# EAGLE design daughterboard (EAGLE 9.6.1)
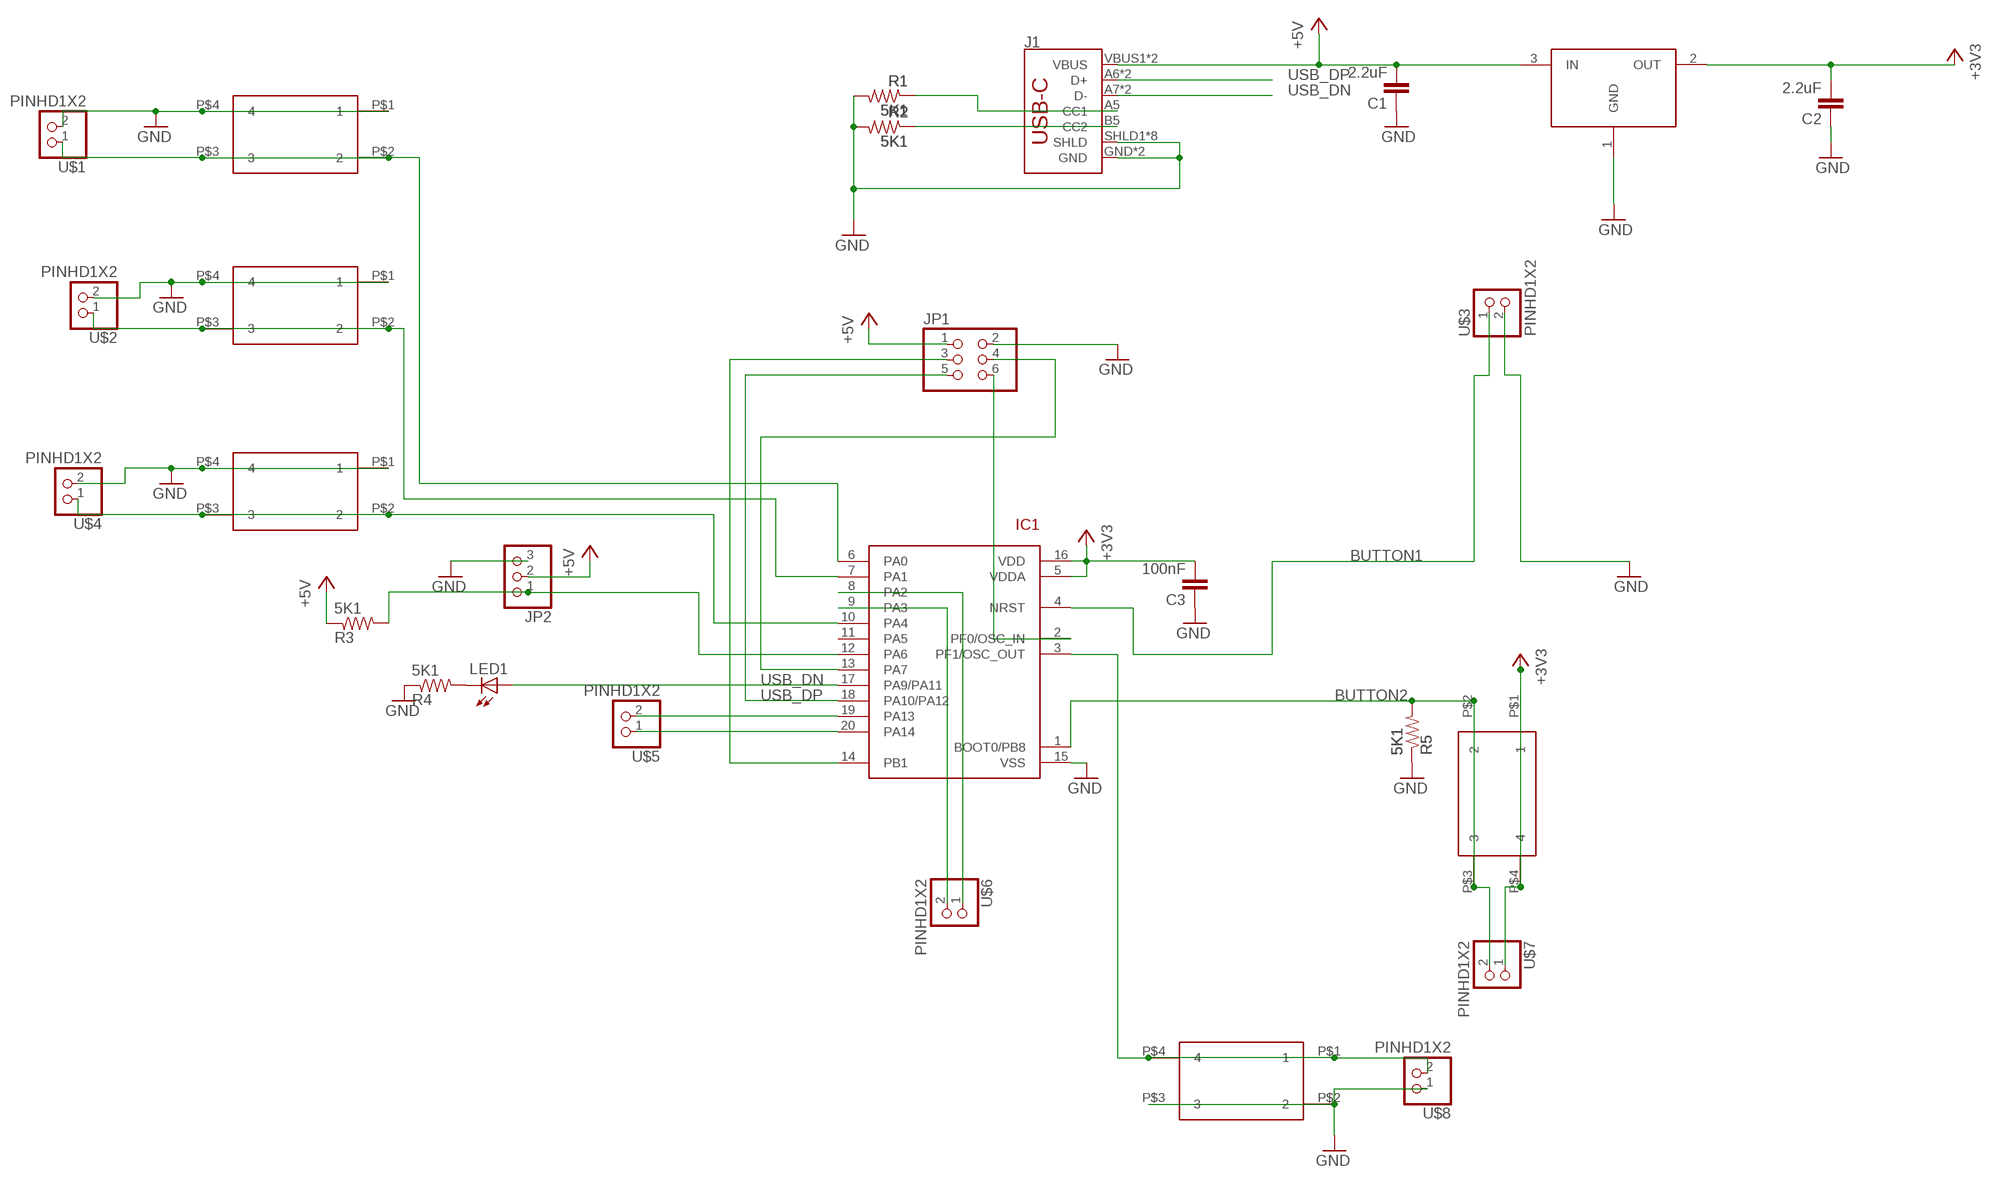
[diagram p0: schematic, sheet 1]

## Parts
C1  2.2uF  CAP0805  [0805@1]
C2  2.2uF  CAP0805  [0805@1]
C3  100nF  CAP0805  [0805@1]
IC1  STM32F042F4  [TSSOP20]
J1  USB_C16PIN  [USB-C-16P]
JP1  PINHD-2X3  [2X03]
JP2  PINHD-1X3CB  [1X03-CLEANBIG]
LED1  LEDCHIP-LED0805  [CHIP-LED0805]
R1  5K1  RESISTOR0805-RES  [0805]
R2  5K1  RESISTOR0805-RES  [0805]
R3  5K1  RESISTOR0805-RES  [0805]
R4  5K1  RESISTOR0805-RES  [0805]
R5  5K1  RESISTOR0805-RES  [0805]
SW1  324_SW  [342_SWICH_FOOT]
SW2  324_SW  [342_SWICH_FOOT]
SW3  324_SW  [342_SWICH_FOOT]
SW4  324_SW  [342_SWICH_FOOT]
SW5  324_SW  [342_SWICH_FOOT]
U1  XC6206_DEV  [SOT23R_INFINEON]
U$1  PINHD1X2  [1X02]
U$2  PINHD1X2  [1X02]
U$3  PINHD1X2  [1X02]
U$4  PINHD1X2  [1X02]
U$5  PINHD1X2  [1X02]
U$6  PINHD1X2  [1X02]
U$7  PINHD1X2  [1X02]
U$8  PINHD1X2  [1X02]

## Nets
+3V3: C2.2 C3.2 IC1.5(VDDA) IC1.16(VDD) SW4.P$1 SW4.P$4 U1.2(OUT) U$7.1
+5V: C1.2 J1.VBUS1(VBUS) J1.VBUS2(VBUS) JP1.1 JP2.2 R3.1 U1.3(IN)
BUTTON1: IC1.4(NRST) U$3.1
BUTTON2: IC1.1(BOOT0/PB8) R5.2 SW4.P$2 SW4.P$3 U$7.2
GND: C1.1 C2.1 C3.1 IC1.15(VSS) J1.GND J1.GND2(GND) J1.SHLD1(SHLD) J1.SHLD2(SHLD) J1.SHLD3(SHLD) J1.SHLD4(SHLD) J1.SHLD5(SHLD) J1.SHLD6(SHLD) J1.SHLD7(SHLD) J1.SHLD8(SHLD) JP1.2 JP2.3 R1.2 R2.2 R4.1 R5.1 SW1.P$1 SW1.P$4 SW2.P$1 SW2.P$4 SW3.P$1 SW3.P$4 SW5.P$2 SW5.P$3 U1.1(GND) U$1.2 U$2.2 U$3.2 U$4.2 U$8.1
N$1: IC1.13(PA7) JP1.4
N$2: IC1.14(PB1) JP1.3
N$3: IC1.19(PA13) U$5.2
N$4: IC1.20(PA14) U$5.1
N$5: IC1.12(PA6) JP2.1 R3.2
N$6: IC1.2(PF0/OSC_IN) JP1.6
N$7: IC1.8(PA2) U$6.1
N$8: IC1.9(PA3) U$6.2
N$9: IC1.10(PA4) SW3.P$2 SW3.P$3 U$4.1
N$10: IC1.7(PA1) SW2.P$2 SW2.P$3 U$2.1
N$11: IC1.6(PA0) SW1.P$2 SW1.P$3 U$1.1
N$12: IC1.3(PF1/OSC_OUT) SW5.P$1 SW5.P$4 U$8.2
N$29: LED1.C R4.2
N$31: J1.B5(CC2) R2.1
N$33: J1.A5(CC1) R1.1
USB_DN: IC1.17(PA9/PA11) J1.A7(D-) J1.B7(D-) LED1.A
USB_DP: IC1.18(PA10/PA12) J1.A6(D+) J1.B6(D+) JP1.5
Unconnected: IC1.11(PA5)

## Library data of the parts
C1-C3 = clock:CAP: Capacitor Standard 0603 ceramic capacitor, and 0.1" leaded capacitor.
IC1 = tx:STM32F042F4
J1 = SparkFun-Connectors:USB_C: USB Type C 16Pin Connector Super Speed pins not available on the 16-pin purely SMD connector so this part is best for USB 2.0 implementations. D1 and D2 are tied together enabling D+/- no matter which way the cable is plugged into the connector. The two channel configuration pins (CC1/2) are exposed. These are normally connected to ground via 5.1k resistors but can be reconfigured for high current/high power applications.; PROD_ID: CONN-14122
JP1 = pinhead:PINHD-2X3: PIN HEADER
JP2 = adafruit_changed:PINHD-1X3: PIN HEADER
LED1 = adafruit:LED: LED OSRAM: - CHIPLED LG R971, LG N971, LY N971, LG Q971, LY Q971, LO R971, LY R971 LH N974, LH R974 LS Q976, LO Q976, LY Q976 LO Q996 - Hyper CHIPLED LW Q18S LB Q993, LB Q99A, LB R99A - SideLED LS A670, LO A670, LY A670, LG A670, LP A670 LB A673, LV A673, LT A673, LW A673 LH A674 LY A675 LS A676, LA A676, LO A676, LY A676, LW A676 LS A679, LY A679, LG A679 - Hyper Micro SIDELED® LS Y876, LA Y876, LO Y876, LY Y876 LT Y87S - SmartLED LW L88C, LW L88S LB L89C, LB L89S, LG L890 LS L89K, LO L89K, LY L89K LS L896, LA L896, LO L896, LY L896 - TOPLED LS T670, LO T670, LY T670, LG T670, LP T670 LSG T670, LSP T670, LSY T670, LOP T670, LYG T670 LG T671, LOG T671, LSG T671 LB T673, LV T673, LT T673, LW T673 LH T674 LS T676, LA T676, LO T676, LY T676, LB T676, LH T676, LSB T676, LW T676 LB T67C, LV T67C, LT T67C, LS T67K, LO T67K, LY T67K, LW E67C LS E67B, LA E67B, LO E67B, LY E67B, LB E67C, LV E67C, LT E67C LW T67C LS T679, LY T679, LG T679 LS T770, LO T770, LY T770, LG T770, LP T770 LB T773, LV T773, LT T773, LW T773 LH T774 LS E675, LA E675, LY E675, LS T675 LS T776, LA T776, LO T776, LY T776, LB T776 LHGB T686 LT T68C, LB T68C - Hyper Mini TOPLED® LB M676 - Mini TOPLED Santana® LG M470 LS M47K, LO M47K, LY M47K Source: http://www.osram.convergy.de/
R1 R2 R5 = joyAnalog:RESISTOR: Resistor Basic schematic elements and footprints for 0603, 1206, and PTH resistors.
R3 R4 = SparkFun-Passives:RESISTOR: Resistor Basic schematic elements and footprints for 0603, 1206, and PTH resistors.
SW1-SW5 = 3pos_slide_switch_centered:324_SW
U1 = 3pos_slide_switch:XC6206_DEV
U$1-U$8 = adafruit_changed:PINHD1X2

## Board
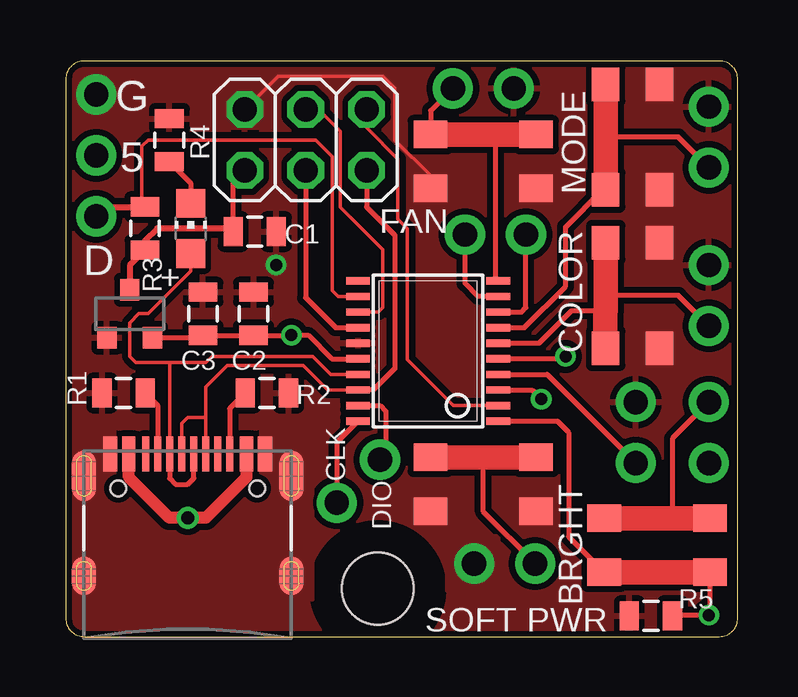
[diagram p1: board, top side]
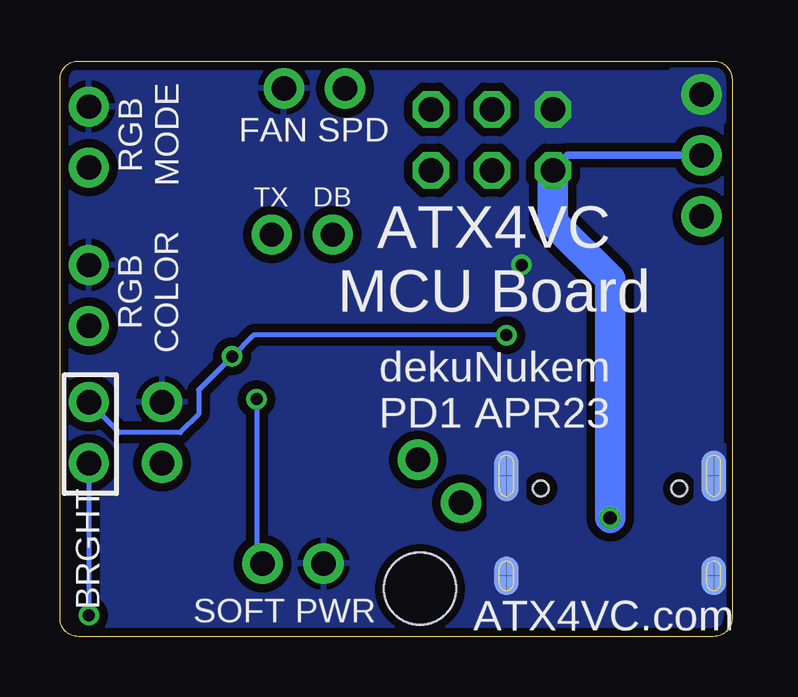
[diagram p2: board, bottom side, seen from below]

Size 28 x 24 mm. Coordinates in mm from the lower left corner, seen from the top.
Outline: 28,0.76 28,23.24 arc90 27.24,24 0.76,24 arc90 0,23.24 0,0.76 arc90 0.76,0 27.24,0 arc90 28,0.76
Copper layers (1*16): Top 0.035mm / dielectric 1.5mm / Bottom 0.035mm
Design rules "deku_2layer_6mil": minimum track width 6mil, minimum drill 15mil, track to track 6mil, track to pad 6mil, pad to pad 6mil, via to via 6mil, smd to smd 6mil, copper to edge 10mil, drill to drill 6mil, minimum pad ring 7mil, minimum via ring 7mil, stop-mask expansion 4mil, vias tented up to drill 25mil, thermal gap 10mil
Holes 3 mm at 13,2
tRestrict: area 10.4,-0.6 to 15.6,4.6

### Footprints (pad centres in the part's own frame; a part is rotated, then mirrored left to right if it is on the bottom)
0805@1 = smd 0.8 x 1.2: 1 -0.9,0; 2 0.9,0
TSSOP20 = smd 0.305 x 0.991: 1 -2.925,-2.918; 2 -2.275,-2.918; 3 -1.625,-2.918; 4 -0.975,-2.918; 5 -0.325,-2.918; 6 0.325,-2.918; 7 0.975,-2.918; 8 1.625,-2.918; 9 2.275,-2.918; 10 2.925,-2.918; 11 2.925,2.918; 12 2.275,2.918; 13 1.625,2.918; 14 0.975,2.918; 15 0.325,2.918; 16 -0.325,2.918; 17 -0.975,2.918; 18 -1.625,2.918; 19 -2.275,2.918; 20 -2.925,2.918
USB-C-16P = smd 0.3 x 1.45: A5 -1.25,0; A6 -0.25,0; A7 0.25,0; A8 1.25,0; B5 1.75,0; B6 0.75,0; B7 -0.75,0; B8 -1.75,0 | smd 0.6 x 1.45: GND -3.225,0; GND2 3.225,0 | smd 1 x 2.1: SHLD1 -4.32,-0.915; SHLD2 4.32,-0.915 | smd 1 x 2.1 bottom: SHLD3 -4.32,-0.915; SHLD4 4.32,-0.915 | smd 1 x 1.6: SHLD5 -4.32,-5.095; SHLD8 4.32,-5.095 | smd 1 x 1.6 bottom: SHLD6 -4.32,-5.095; SHLD7 4.32,-5.095 | smd 0.55 x 1.45: VBUS1 -2.45,0; VBUS2 2.45,0 | hole 0.65: -2.89,-1.445; 2.89,-1.445
2X03 = drill 1.016 octagon: 1 -2.54,-1.27; 2 -2.54,1.27; 3 0,-1.27; 4 0,1.27; 5 2.54,-1.27; 6 2.54,1.27
1X03-CLEANBIG = drill 1.016 pad 1.676: 1 -2.54,0; 2 0,0; 3 2.54,0
CHIP-LED0805 = smd 1.2 x 1.2: A 0,-1.05; C 0,1.05
0805 = smd 0.8 x 1.2: 1 -0.9,0; 2 0.9,0
342_SWICH_FOOT = smd 1.4 x 1.15: P$1 -2.2,-1.125; P$2 -2.2,1.125; P$3 2.2,1.125; P$4 2.2,-1.125
SOT23R_INFINEON = smd 0.8 x 0.9: 1 -0.95,-1; 2 0.95,-1; 3 0,1
1X02 = drill 1.016 pad 1.676: 1 -1.27,0; 2 1.27,0

### Placement (x,y rotation side)
C1  7.87,16.89 180 top
C2  7.82,13.46 270 top
C3  5.71,13.46 270 top
IC1  15.1,11.91 90 top
J1  5.08,7.62 0 top
JP1  10,20.71 0 top
JP2  1.27,20.07 90 top
LED1  5.21,17.02 0 top
R1  2.41,10.16 180 top
R2  8.38,10.16 0 top
R3  3.3,17.02 90 top
R4  4.32,20.7 270 top
R5  24.38,0.86 0 top
SW1  23.62,14.22 90 top
SW2  23.62,20.83 90 top
SW3  17.4,19.81 0 top
SW4  24.64,3.81 180 top
SW5  17.4,6.35 180 top
U1  2.67,13.46 0 top
U$1  26.8,14.22 90 top
U$2  26.8,20.83 90 top
U$3  23.75,8.51 90 top
U$4  17.4,22.86 0 top
U$5  12.19,6.48 45 top
U$6  17.91,16.76 180 top
U$7  26.8,8.51 270 top
U$8  18.29,3.05 0 top

### Tracks (layer width: path | path; a pad name or v marks a point on that pad's centre or on a via)
+3V3  (via drill 0.5)
  Top 0.203: U1.2 5.62,12.46 C3.2 C2.2 9.39,12.56 v9.4,12.57 10.1,12.57 11.09,11.58 IC1.16 | v20.83,11.68 20.73,11.58 IC1.5 | U$7.1 25.27,8.26 25.27,4.93
  Top 1.016: SW4.P$1 25.27,4.93 SW4.P$4
  Bottom 0.203: v9.4,12.57 19.94,12.57 v20.83,11.68 22.23,10.29 22.23,9.27 22.99,8.51 25.53,8.51 U$7.1
+5V  (via drill 0.55)
  Top 0.203: JP1.1 6.97,18.95 C1.2
  Top 0.254: 6.85,17.02 3.81,17.02 3.3,16.51 R3.1 2.67,15.48 U1.3
  Top 0.305: C1.2 6.85,17.02
  Top 0.508: J1.VBUS1 2.63,6.64 4.32,4.95 v5.08,4.95 5.84,4.95 7.53,6.64 J1.VBUS2
  Bottom 0.305: JP1.1 6.83,20.07 JP2.2
  Bottom 1.27: JP1.1 7.46,17.28 5.08,14.9 v5.08,4.95
BUTTON1
  Top 0.203: IC1.4 20.06,10.93 U$3.1
BUTTON2  (via drill 0.5)
  Top 0.203: SW4.P$3 20.95,4.17 20.95,8.51 20.48,8.98 IC1.1 | R5.2 25.31,0.89 v26.8,0.89 26.84,0.93 SW4.P$2
  Top 1.016: SW4.P$3 SW4.P$2
  Bottom 0.203: U$7.2 v26.8,0.89
GND  (via drill 0.5)
  Top 0.152: JP1.2 8.85,23.37 13.21,23.37 13.72,22.86 13.72,20.7 15.2,19.22 SW3.P$1
  other vias: 8.76,15.49
  pour Top (isolate 0.254): 0,24 0,0 28,0 28,24
  pour Bottom (isolate 0.356): 0,24 0,0 28,0 28,24
  pour Bottom (no thermals): 0.25,21.46 2.54,21.46 2.54,23.75 0.25,23.75
  pour Bottom (no thermals): 6.35,20.83 8.64,20.83 8.64,23.11 6.35,23.11
  pour Bottom (no thermals): 8.64,1.27 10.16,1.27 10.16,8.13 8.64,8.13
  pour Bottom (no thermals): 0,1.14 1.52,1.14 1.52,8 0,8
  pour Top (no thermals): 0.25,23.75 2.41,23.75 2.41,21.46 0.25,21.46
  pour Top (no thermals): 6.35,23.37 8.51,23.37 8.51,21.21 6.35,21.21
  pour Top (no thermals): 8.13,8.76 10.29,8.76 10.29,1.52 8.13,1.52
  pour Top (no thermals): 0.13,8.76 2.03,8.76 2.03,1.02 0.13,1.02
  pour Top (no thermals): 15.88,4.19 18.03,4.19 18.03,1.91 15.88,1.91
N$1
  Top 0.152: JP1.4 10.53,21.98 11.43,21.08 11.43,17.91 13.21,16.13 13.21,13.72 13.02,13.53 IC1.13
N$2
  Top 0.203: JP1.3 10,14.13 11.25,12.88 IC1.14
N$3
  Top 0.203: IC1.19 13.1,9.63 13.34,9.4 13.34,7.62 U$5.2
N$4
  Top 0.203: IC1.20 11.29,8.1 U$5.1
N$5
  Top 0.152: IC1.12 11.35,14.18 11.1,14.43 11.1,20.02 10.41,20.7 3.43,20.7 3.17,20.45 3.17,17.92
  Top 0.254: R3.2 3.17,17.92 1.66,17.92 JP2.1
N$6
  Top 0.152: IC1.2 16.15,9.63 14.22,11.56 14.22,17.02 13.84,17.4 13.84,19.91 12.54,21.22 JP1.6
N$7
  Top 0.203: IC1.8 18.99,13.53 19.18,13.72 U$6.1
N$8
  Top 0.203: IC1.9 17.19,14.18 16.64,14.73 U$6.2
N$9
  Top 0.203: U$4.1 15.2,21.93 SW3.P$2 | IC1.10 17.91,14.94 17.91,20.94
  Top 1.016: SW3.P$3 17.91,20.94 SW3.P$2
N$10
  Top 0.203: IC1.7 19.11,12.88 20.83,14.61 20.83,17.08 22.38,18.63 SW2.P$2 | U$2.1 25.53,20.83 22.5,20.83
  Top 1.016: SW2.P$3 22.5,20.83 SW2.P$2
N$11
  Top 0.203: IC1.6 19.73,12.23 21.08,13.59 22.48,13.59 22.5,13.59 | U$1.1 25.53,14.22 22.5,14.22
  Top 1.016: SW1.P$3 22.5,14.22 22.5,13.59 | SW1.P$2 22.48,12.04 22.48,13.59
N$12  (via drill 0.5)
  Top 0.203: IC1.3 19.44,10.28 v19.81,9.91 | U$8.2 17.4,5.21 17.4,7.47
  Top 1.016: SW5.P$4 17.4,7.47 SW5.P$1
  Bottom 0.203: v19.81,9.91 19.81,3.3 U$8.2
N$29
  Top 0.203: R4.2 5.21,18.91 LED1.C
N$31
  Top 0.203: R2.1 6.83,9.51 J1.B5
N$33
  Top 0.203: R1.1 3.83,9.64 J1.A5
USB_DN
  Top 0.152: IC1.17 11.04,10.93 10.29,11.68 6.1,11.68 5.84,11.43 4.33,11.43 | LED1.A 5.21,15.24 3.43,13.46 3.05,13.46 2.67,13.08 2.67,11.68 2.92,11.43 4.33,11.43 | J1.B7 4.33,11.43
  Top 0.203: J1.B7 4.33,6.59 4.57,6.35 5.08,6.35 5.33,6.6 J1.A7
USB_DP
  Top 0.152: J1.B6 5.83,9.14 | 5.83,9.14 5.83,10.4 6.73,11.3 9.91,11.3 10.93,10.28 IC1.18 | J1.A6 4.83,8.89 5.08,9.14 5.83,9.14
  Top 0.203: JP1.5 12.54,17.92 13.72,16.74 13.72,11.18 12.82,10.28 IC1.18

### Text on the board
tNames: G | MODE | 5 | FAN | D | COLOR | CLK | DIO | BRGHT | SOFT PWR
bNames: FAN SPD | RGB / MODE | DB | TX | ATX4VC / MCU Board | RGB / COLOR | dekuNukem / PD1 APR23 | BRGHT | ATX4VC.com | SOFT PWR